# Altium schematic sheet Sensor.SchDoc
size A4
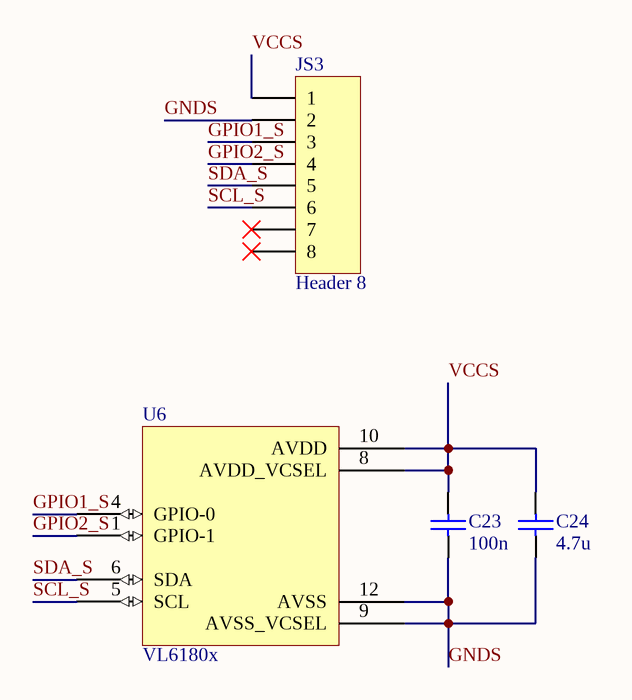
[diagram p0: Sensor.SchDoc]

## Parts
C23  100n  [RES 0603/1608]
C24  4.7u  [CAP 0603/1608]
JS3  Header 8  [7-215464-8]
U6  VL6180x  [LGA12]

## Nets
GNDS: C23.2 C24.1 JS3.2 U6.9(AVSS_VCSEL) U6.12(AVSS)
GPIO1_S: JS3.3 U6.4(GPIO-0)
GPIO2_S: JS3.4 U6.1(GPIO-1)
SCL_S: JS3.6 U6.5(SCL)
SDA_S: JS3.5 U6.6(SDA)
VCCS: C23.1 C24.2 JS3.1 U6.8(AVDD_VCSEL) U6.10(AVDD)

Not connected (* = marked no-connect by the designer): JS3 7* 8*

## Library data of the parts
C23 = Cap: MULTICOMP  MCSH21B104K100CT  Condensateur céramique multicouche CMS, 0805 [2012 Metric], 0.1 µF, 10 V, ± 10%, X7R, Série MCSH; Fournisseur: Farnell; RefFournisseur: 1856422; Fabricant: MULTICOMP; Footprint: 0603; RefFabricant: MCSH21B104K100CT; Value: 100n
C24 = Cap: WALSIN  0603X475K6R3CT  Condensateur céramique multicouche CMS, 0603 [1608 Metric], 4.7 µF, 6.3 V, ± 10%, X5R; Fournisseur: Farnell; RefFournisseur: 2496930; Fabricant: WALSIN; Footprint: 0603 [1608 Metric]; RefFabricant: 0603X475K6R3CT; Value: 4.7u
JS3 = Header 8: AMP - TE CONNECTIVITY  7-215460-8  Connecteur carte-à-carte, Entrée latérale, 1.27 mm, 8 Contact(s), Embase, Série Micro-MaTch; Fournisseur: Farnell; RefFournisseur: 148751; Fabricant: AMP - TE CONNECTIVITY; RefFournisseur: 7-215460-8; Footprint: 7-215460-8
U6 = VL6180x: STMICROELECTRONICS  VL6180XV0NR/1  Capteur de proximité, Numérique, 100 mm, LGA, 12 Broche(s), 2.6 V, 3 V; RefFournisseur: 2462820; Fournisseur: Farnell; Fabricant: STmicroelectronics; RefFabricant: VL6180XV0NR/1